# EAGLE design driverboard (EAGLE 9.1.3)
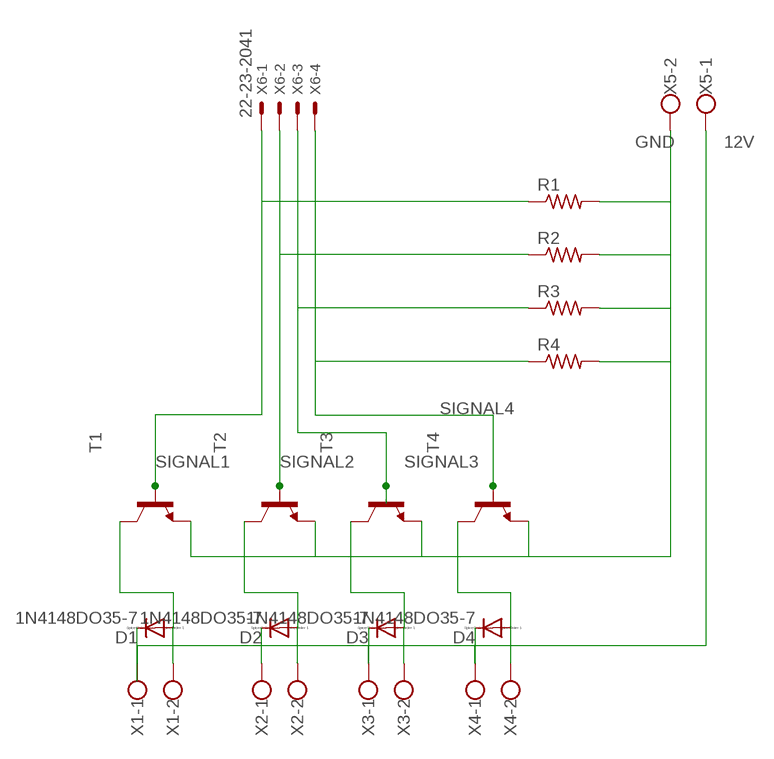
[diagram p0: schematic, sheet 1]

## Parts
D1  1N4148DO35-7  [DO35-7]
D2  1N4148DO35-7  [DO35-7]
D3  1N4148DO35-7  [DO35-7]
D4  1N4148DO35-7  [DO35-7]
R1  R-US_0204/7  [0204/7]
R2  R-US_0204/7  [0204/7]
R3  R-US_0204/7  [0204/7]
R4  R-US_0204/7  [0204/7]
T1  BCV72-NPN-SOT23-BEC  [SOT23-BEC]
T2  BCV72-NPN-SOT23-BEC  [SOT23-BEC]
T3  BCV72-NPN-SOT23-BEC  [SOT23-BEC]
T4  BCV72-NPN-SOT23-BEC  [SOT23-BEC]
X1  W237-102  [W237-102]
X2  W237-102  [W237-102]
X3  W237-102  [W237-102]
X4  W237-102  [W237-102]
X5  W237-102  [W237-102]
X6  22-23-2041  [22-23-2041]

## Nets
12V [Power]: D1.C D2.C D3.C D4.C X1.1 X2.1 X3.1 X4.1 X5.1
GND [Power]: R1.2 R2.2 R3.2 R4.2 T1.E T2.E T3.E T4.E X5.2
N$2 [Power]: D4.A T4.C X4.2
N$3 [Power]: D3.A T3.C X3.2
N$4 [Power]: D2.A T2.C X2.2
N$6 [Power]: D1.A T1.C X1.2
SIGNAL1: R1.1 T1.B X6.1
SIGNAL2: R2.1 T2.B X6.2
SIGNAL3: R3.1 T3.B X6.3
SIGNAL4: R4.1 T4.B X6.4

## Library data of the parts
D1-D4 = diode:1N4148: DIODE high speed (Philips)
R1-R4 = resistor:R-US_: RESISTOR, American symbol
T1-T4 = transistor:*-NPN-: NPN Transistror BF959 corrected 2008.03.06
X1-X5 = con-wago-500:W237-102: WAGO SCREW CLAMP; MPN: 237-102; OC_FARNELL: unknown; OC_NEWARK: 70K9898
X6 = con-molex:22-23-2041: .100" (2.54mm) Center Header - 4 Pin; MF: MOLEX; MPN: 22-23-2041; OC_FARNELL: 1462920; OC_NEWARK: 38C0355

## Net classes
1 Power: width 0.61 mm, clearance 0.203 mm

## Board
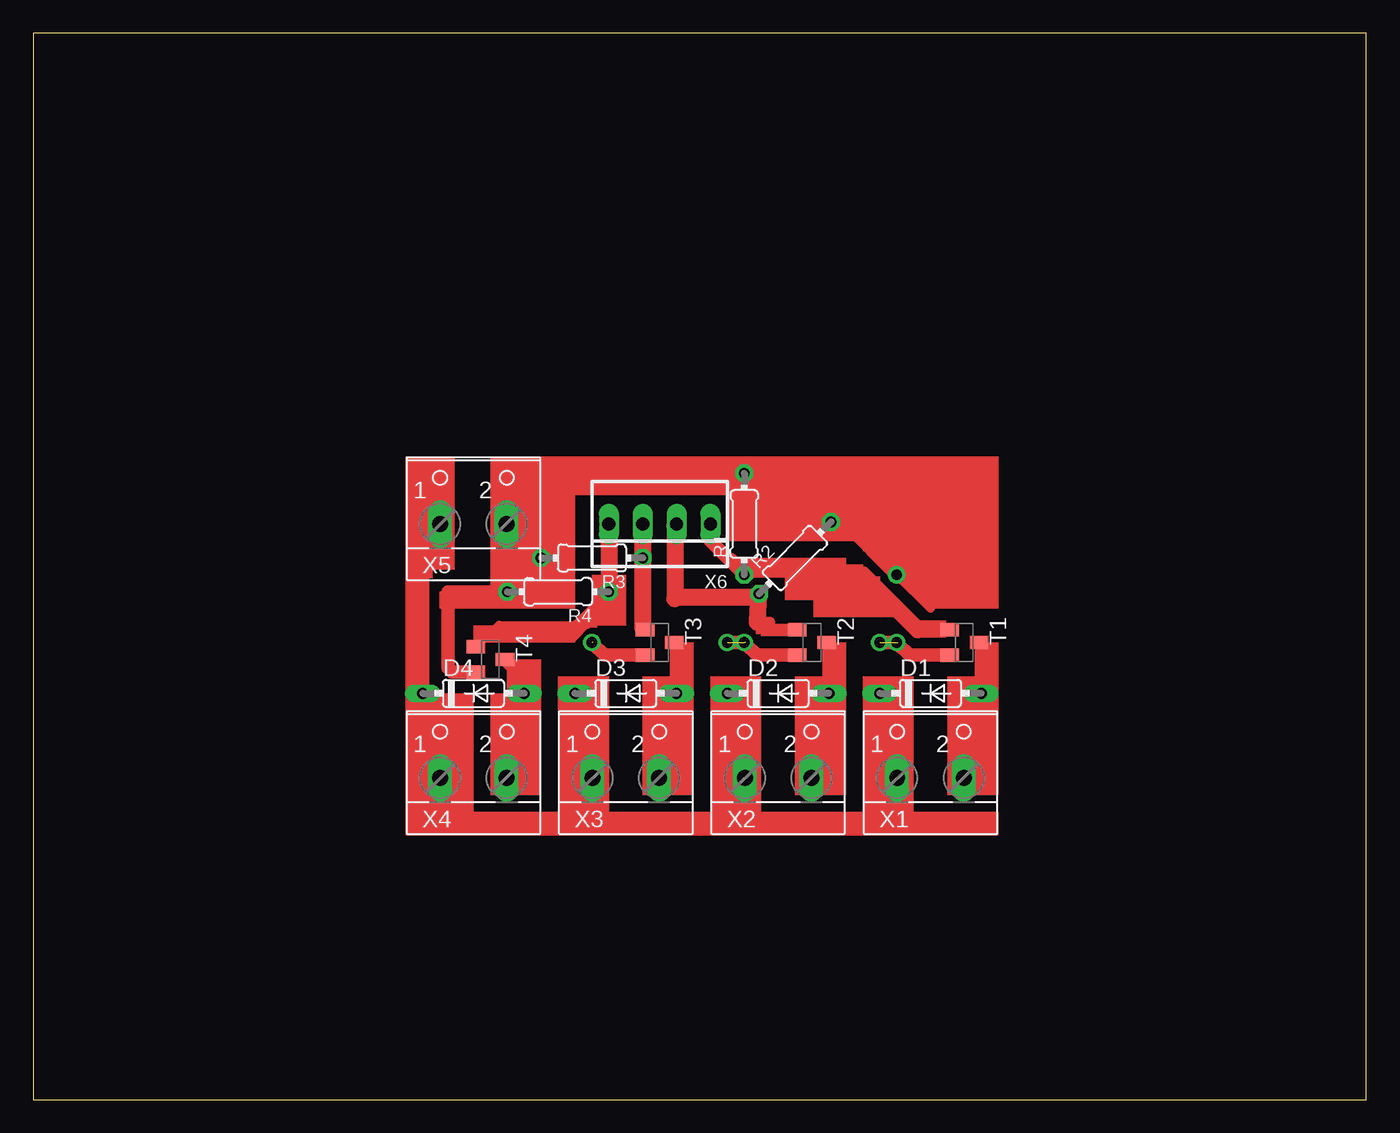
[diagram p1: board, top side]
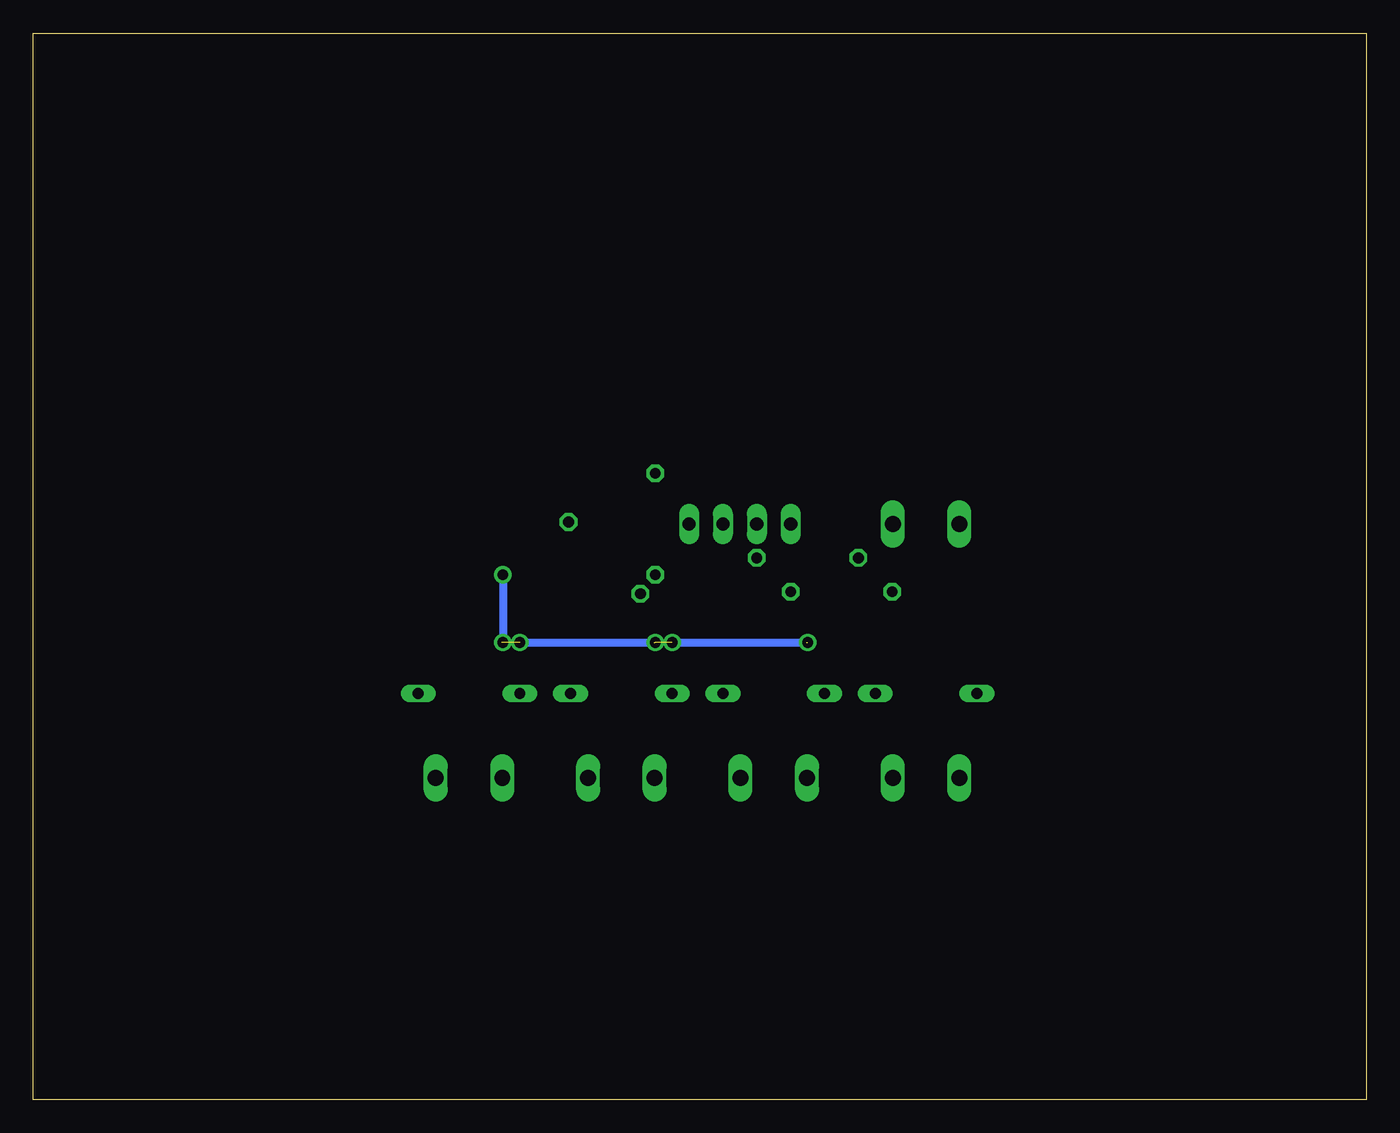
[diagram p2: board, bottom side, seen from below]

Size 100 x 80 mm. Coordinates in mm from the lower left corner, seen from the top.
Outline: 0,0 100,0 100,80 0,80 0,0
Copper layers (1*16): Top 0.035mm / dielectric 1.5mm / Bottom 0.035mm
Design rules "default": minimum track width 6mil, minimum drill 0.35mm, track to track 6mil, track to pad 6mil, pad to pad 6mil, via to via 6mil, smd to smd 6mil, copper to edge 40mil, drill to drill 6mil, minimum pad ring 10mil, minimum via ring 8mil, stop-mask expansion 4mil, vias tented up to drill 0mil, thermal gap 10mil

### Footprints (pad centres in the part's own frame; a part is rotated, then mirrored left to right if it is on the bottom)
DO35-7 = drill 0.813 long: A 3.81,0; C -3.81,0
0204/7 = drill 0.813 octagon: 1 -3.81,0; 2 3.81,0
SOT23-BEC = smd 1 x 1.4: B -0.95,-1.1; C 0,1.1; E 0.95,-1.1
W237-102 = drill 1.194 long: 1 -2.5,-1.27; 2 2.5,-1.27
22-23-2041 = drill 1 long: 1 -3.81,0; 2 -1.27,0; 3 1.27,0; 4 3.81,0

### Placement (x,y rotation side)
D1  67.31,30.48 0 top
D2  55.88,30.48 0 top
D3  44.45,30.48 0 top
D4  33.02,30.48 0 top
R1  53.34,43.18 90 top
R2  57.15,40.64 45 top
R3  41.91,40.64 180 top
R4  39.37,38.1 180 top
T1  69.85,34.29 270 top
T2  58.42,34.29 270 top
T3  46.99,34.29 270 top
T4  34.29,33.02 270 top
X1  67.31,25.4 0 top
X2  55.88,25.4 0 top
X3  44.45,25.4 0 top
X4  33.02,25.4 0 top
X5  33.02,44.45 0 top
X6  46.99,43.18 180 top

### Tracks (layer width: path | path; a pad name or v marks a point on that pad's centre or on a via)
12V
  Top 1.016: D1.C 63.5,26.67 64.81,25.36 X1.1 64.77,24.09 64.77,20.32 53.34,20.32 | D2.C 52.07,26.67 53.38,25.36 X2.1 53.38,20.36 53.34,20.32 | D3.C 40.64,26.67 41.95,25.36 X3.1 41.95,20.36 41.91,20.32 | X5.1 29.21,41.87 D4.C 29.21,26.67 30.52,25.36 X4.1 30.48,24.09 30.48,20.32 41.91,20.32 | 41.91,20.32 53.34,20.32
GND  (via drill 0.8 pad 1.3)  (5 unrouted)
  Top 0.61: v64.77,39.37 67.31,36.83 67.31,37.59 65.91,38.99 66.29,38.99 67.69,37.59
  Top 1.016: 35.52,40.64 X5.2 35.52,46.95 35.56,46.99 R1.2 57.15,46.99 60.33,43.81 | T3.E 42.86,33.34 42,34.2 42,34.29 | T2.E 54.29,33.34 53.43,34.2 53.43,34.29 | T1.E 65.72,33.34 64.86,34.2 64.86,34.29 | R3.2 35.52,40.64 | 35.52,40.64 35.52,39.37 35.52,38.14 R4.2 31.11,38.1 31.11,32.38 31.43,32.07 T4.E | 60.33,43.81 60.96,43.18 v64.77,39.37 | R2.2 60.33,43.81 | v64.77,34.29 v63.5,34.29 | v53.34,34.29 v52.07,34.29
  Bottom 0.61: v64.77,39.37 v64.77,34.29 | v63.5,34.29 v53.34,34.29 | v52.07,34.29 v41.91,34.29
  other vias: 35.56,38.1
N$1
  Top 1.016: 54.1,40.13 52.7,40.13 52.32,40.51
N$2
  Top 1.016: X4.2 35.52,25.36 36.83,26.67 D4.A 36.83,31.58 T4.C
N$3
  Top 1.016: X3.2 46.99,24.09 46.99,22.86 46.99,25.4 48.26,26.67 D3.A 48.26,34.12 T3.C
N$4
  Top 1.016: X2.2 58.38,25.36 59.69,26.67 D2.A 59.69,34.12 T2.C
N$5
  Top 1.016: 40.39,34.8 41.4,35.81 41.53,35.81
N$6
  Top 1.016: X1.2 69.81,25.36 71.12,26.67 D1.A 71.12,34.12 T1.C
SIGNAL1
  Top 0.406: 66.36,35.24 T1.B | R1.1 62.23,39.37
  Top 1.016: X6.1 50.8,41.91 R1.1
  Top 1.27: 62.23,39.37 66.36,35.24
SIGNAL2
  Top 0.406: T2.B 55.82,35.24 55.24,35.81
  Top 0.813: 54.33,35.81 55.24,35.81
  Top 1.016: 48.13,37.59 48.3,37.69 | 54.2,37.69 R2.1 | X6.2 48.13,43.05
  Top 1.27: 54.33,35.81 R2.1 | 48.3,37.69 54.2,37.69 | 48.13,43.05 48.13,37.59
SIGNAL3
  Top 0.406: 45.72,35.41 T3.B
  Top 1.27: X6.3 R3.1 45.72,35.41
SIGNAL4
  Top 0.406: T4.B 34.92,35.7 34.92,35.69 40.77,35.69
  Top 0.61: 40.77,35.69 R4.1
  Top 1.27: X6.4 R4.1
(copper drawn outside any net)
  shapes: Top area x52